# Altium project AMS LV.PrjPcb
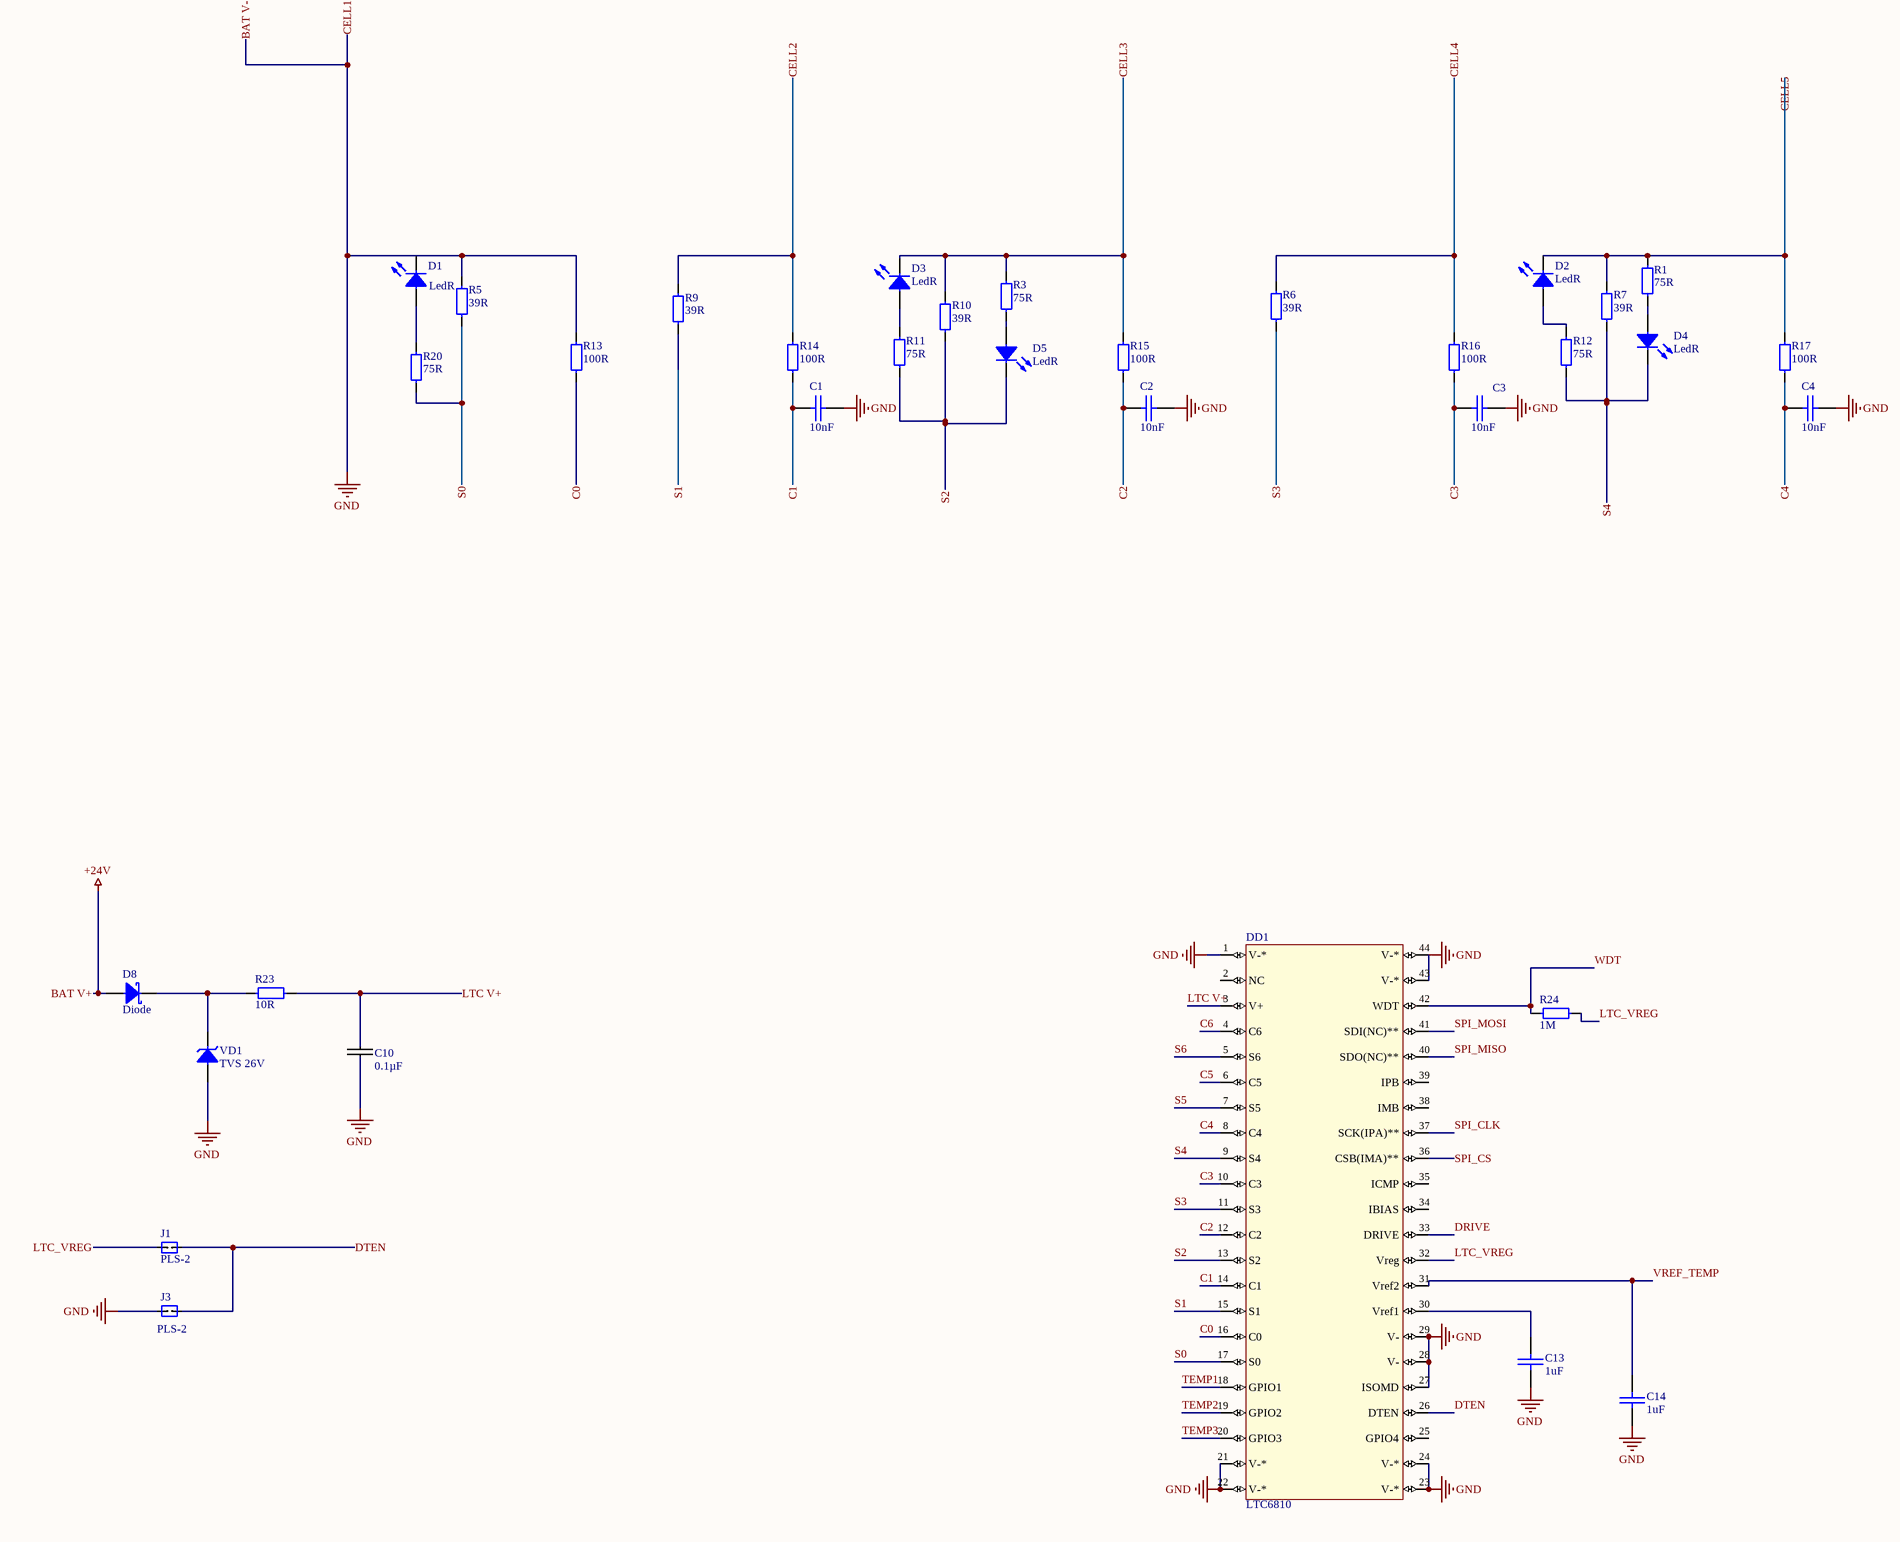
[diagram p0: AMS_LV_6.SchDoc, top left]
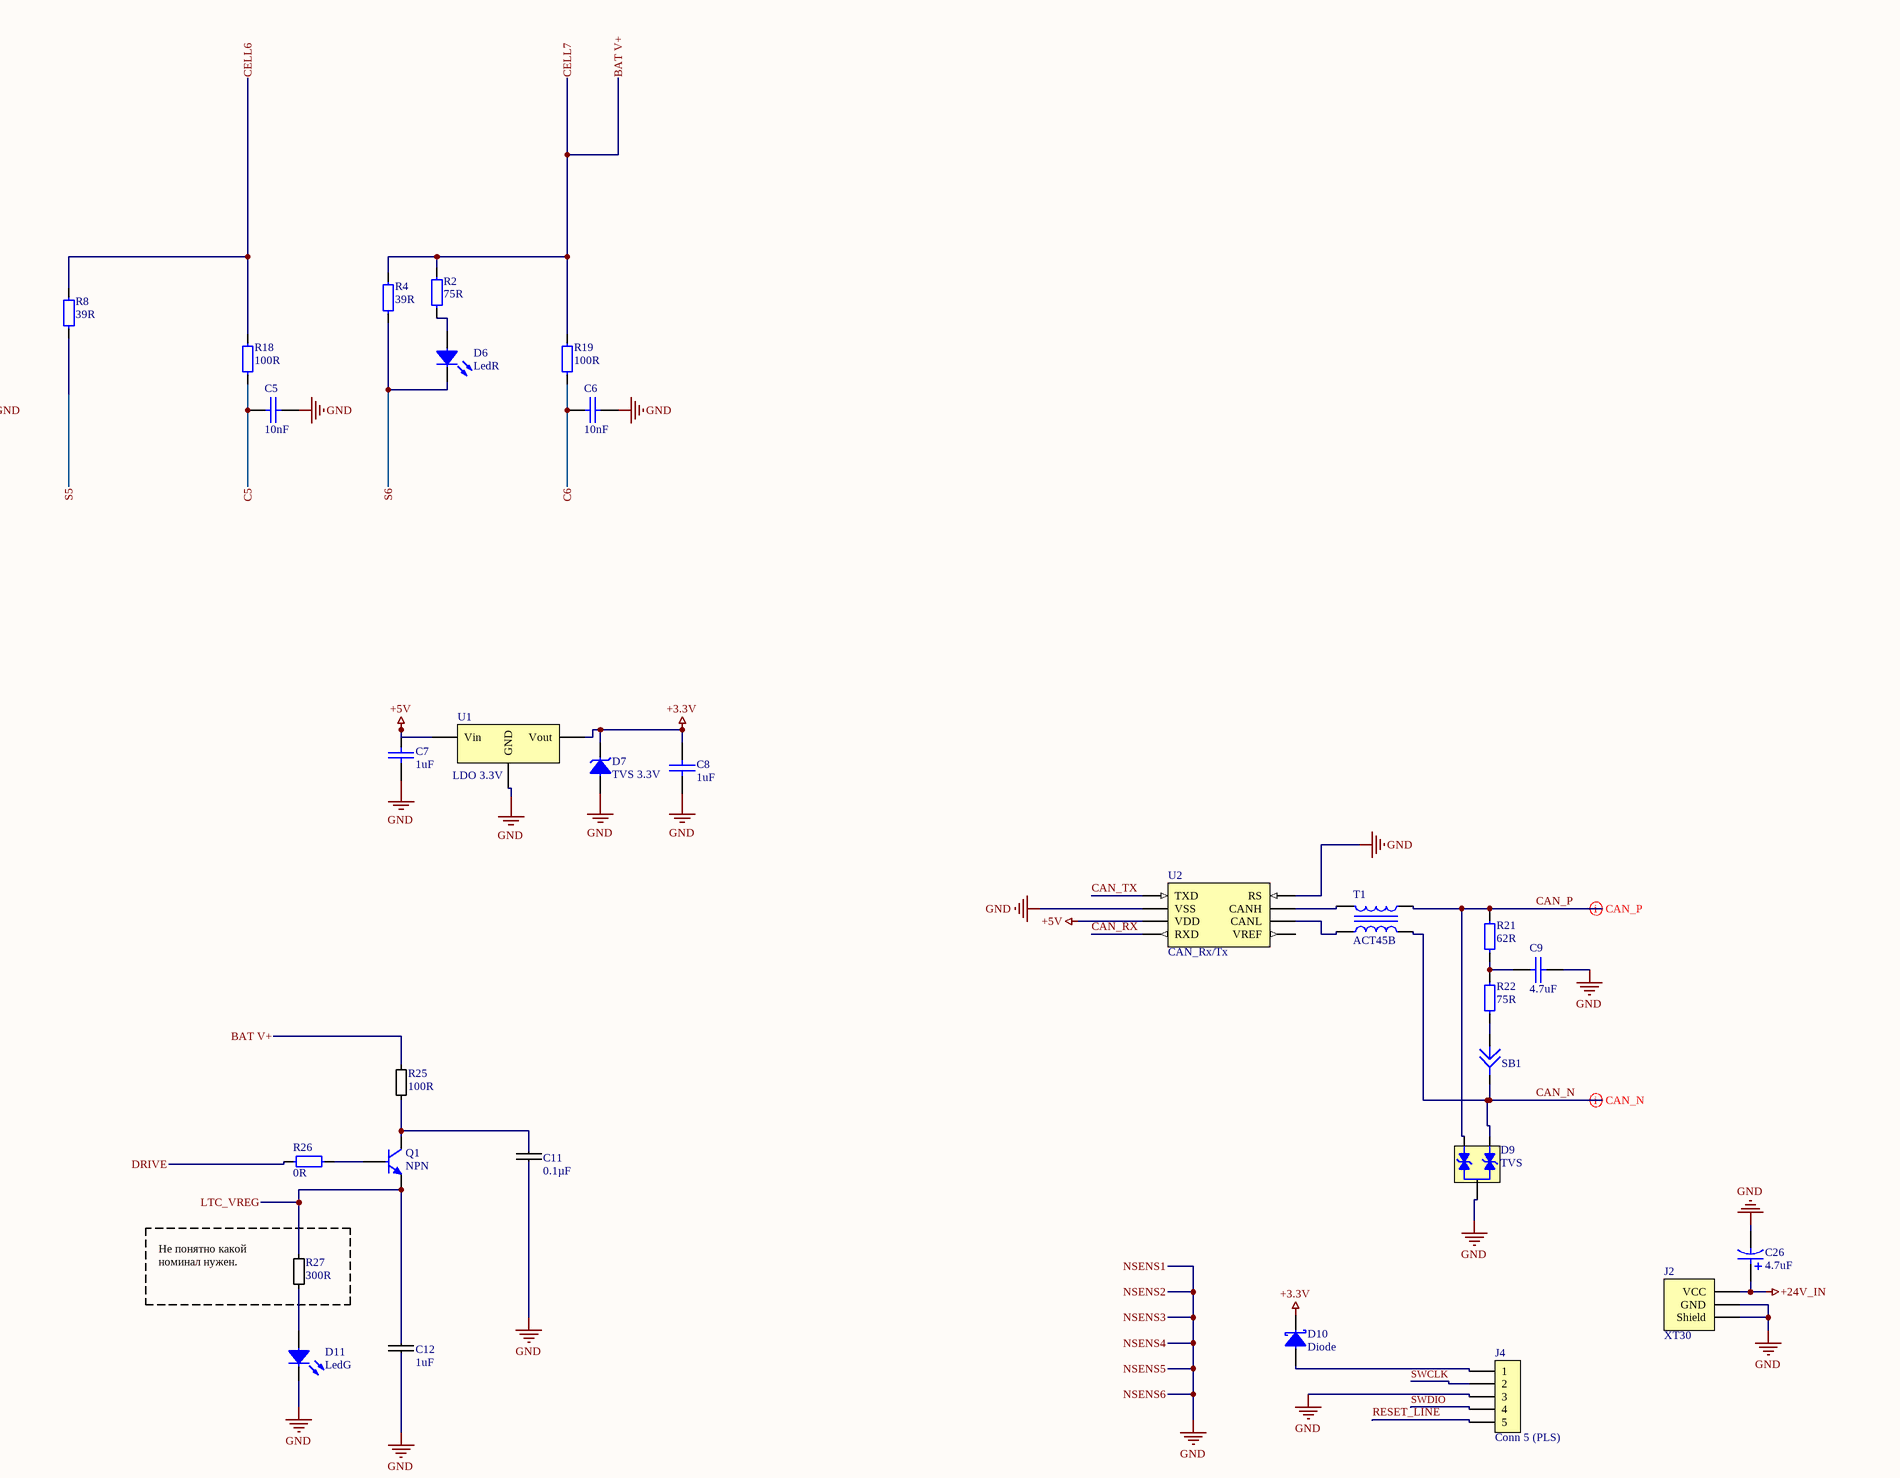
[diagram p1: AMS_LV_6.SchDoc, top right]
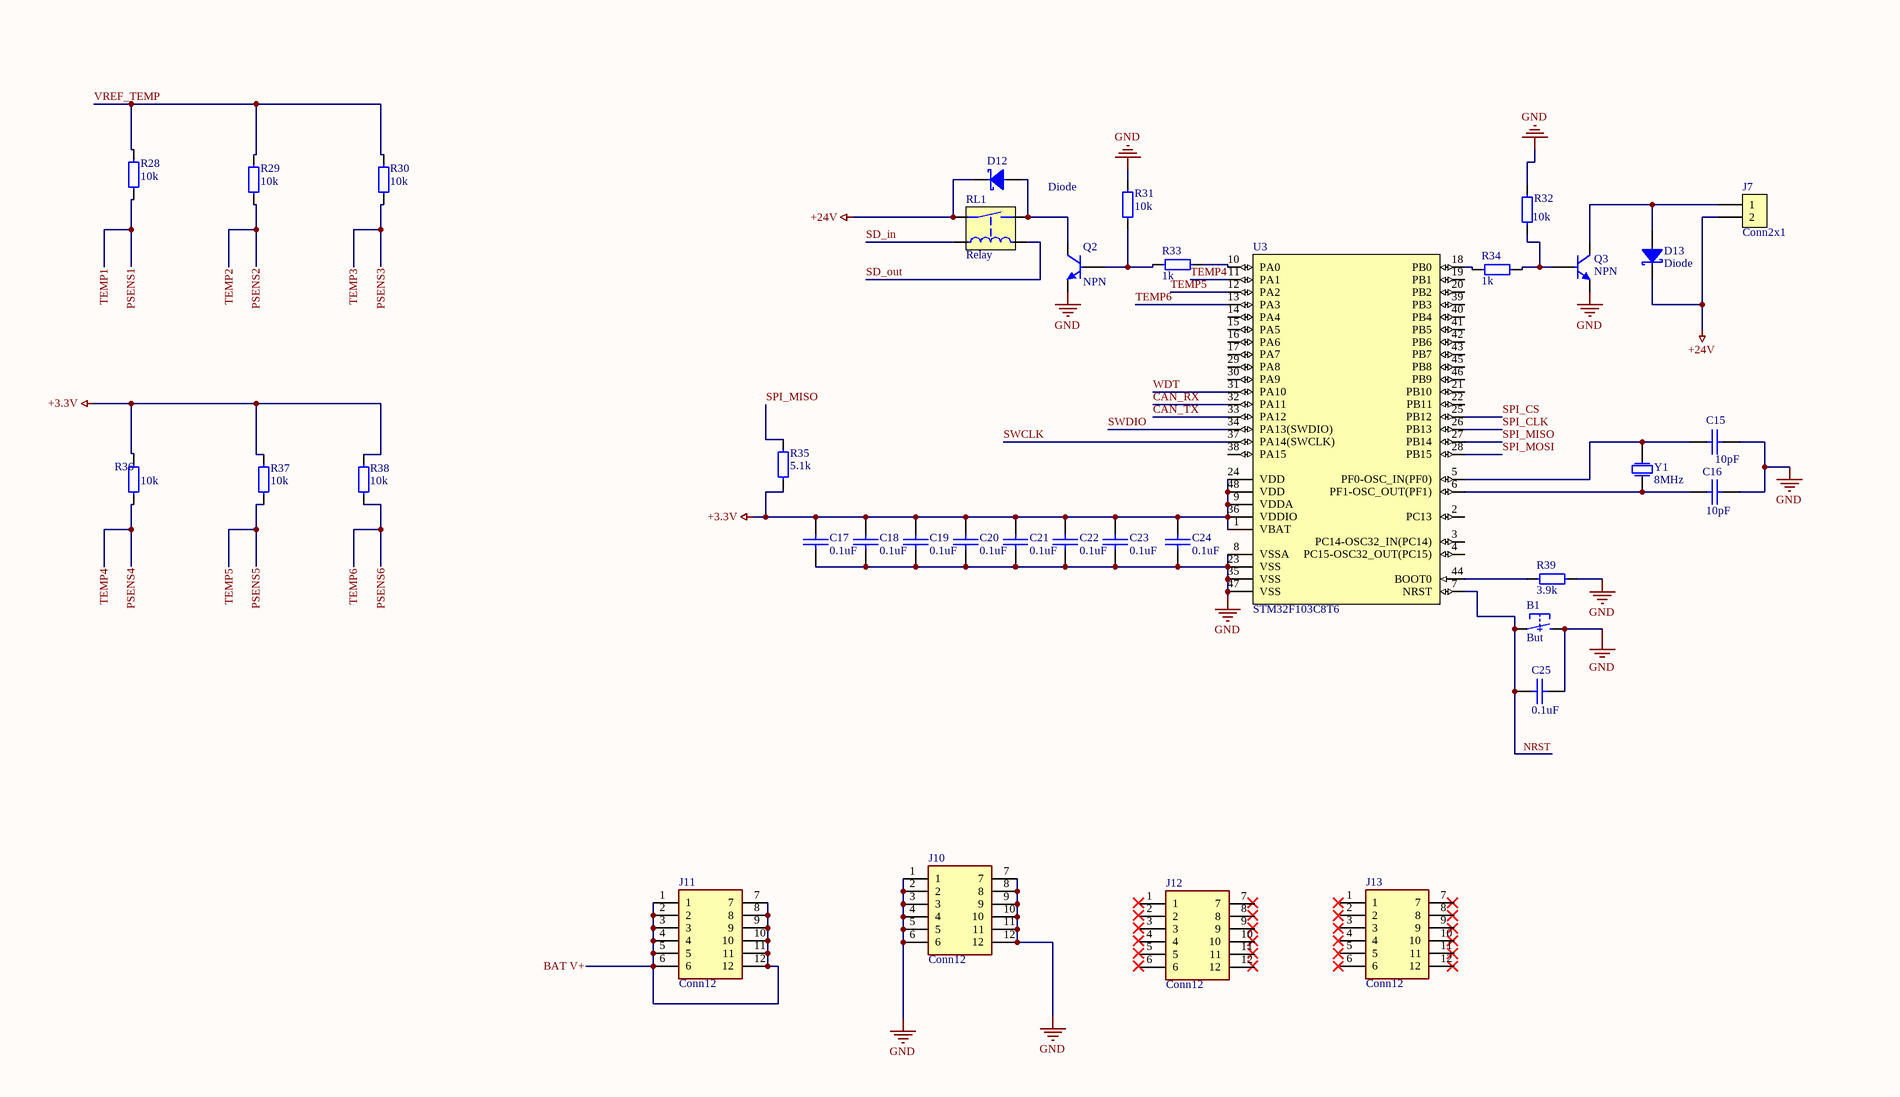
[diagram p2: AMS_LV_6.SchDoc, bottom left]
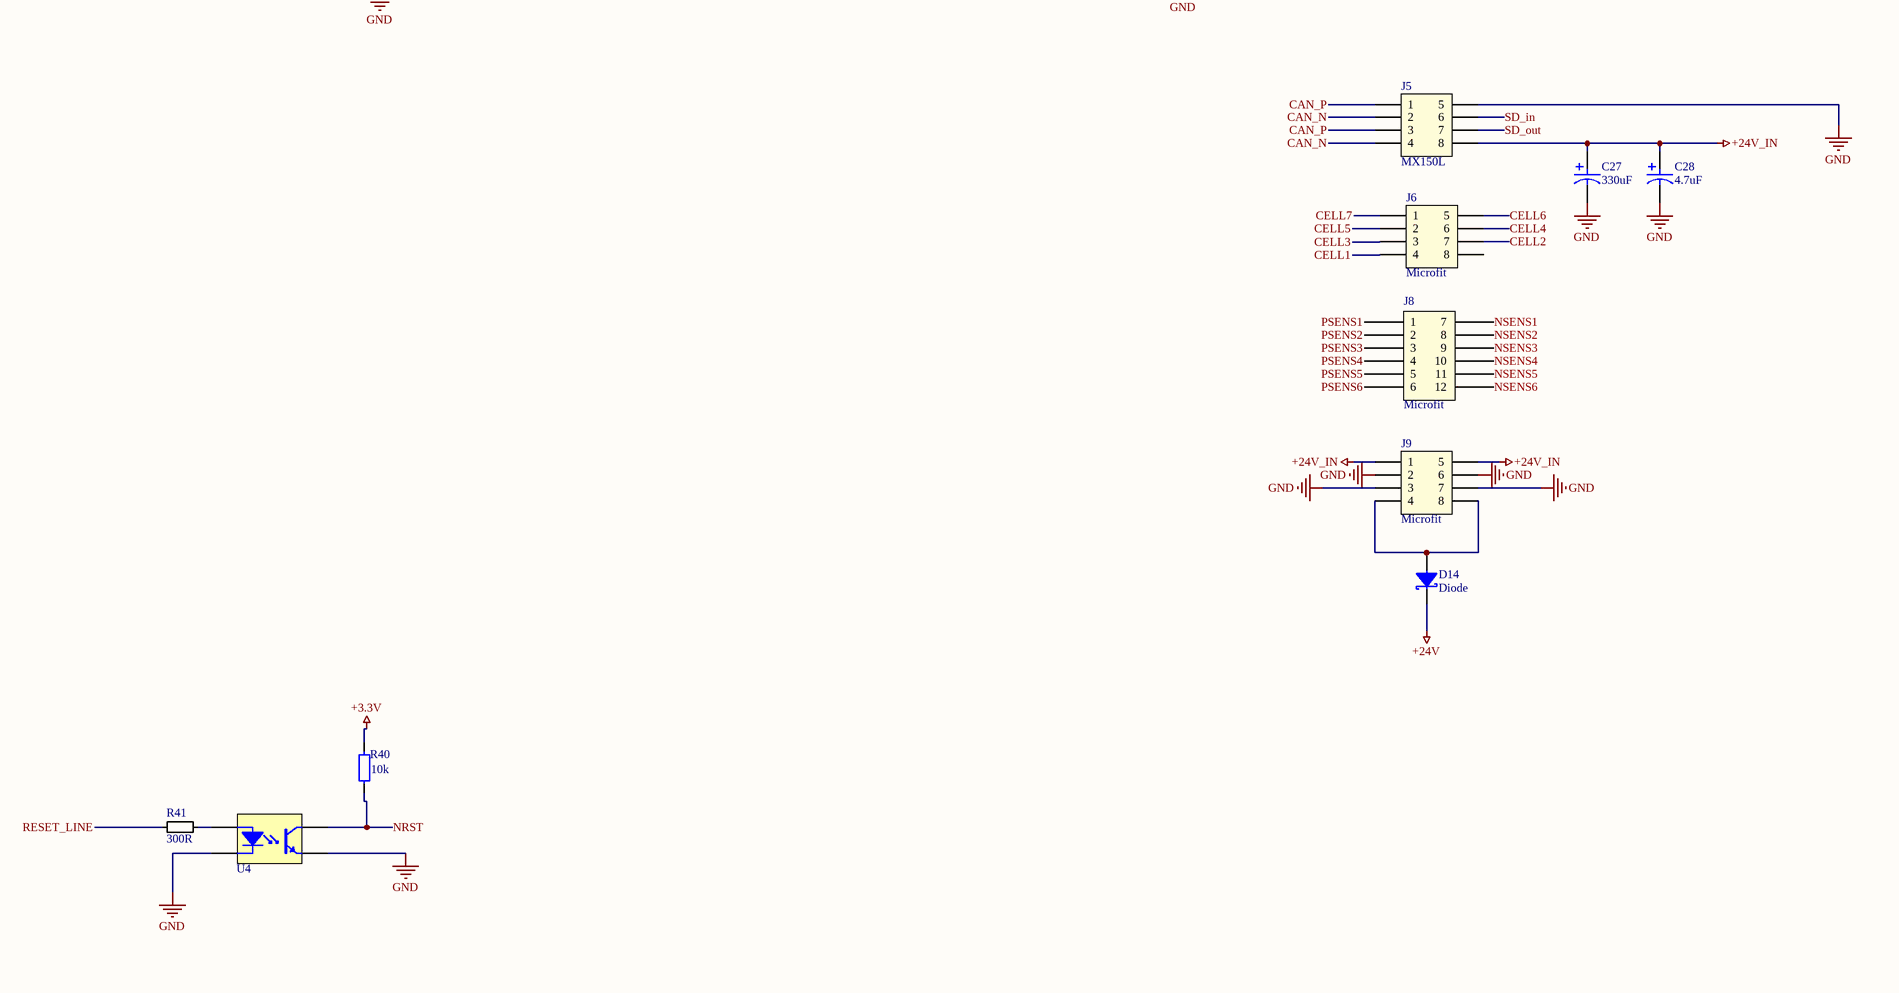
[diagram p3: AMS_LV_6.SchDoc, bottom right]
2 sheets, 121 parts. Net scope: global (net labels, ports and power ports of the same name join across sheets).
Board file: AMS-LV.PcbDoc
Sheets:
  AMS_LV_6.SchDoc
  DC-DC_4-36V_2A.SchDoc

## Sheet AMS_LV_6.SchDoc: AMS Slave mk1
size A1; CheckedBy: h; Author: 0; CompanyName: n; Organization: Altium Limited; Address1: FS BMSTU; Address2: Ildar_BH; ListNumber: 1

### Parts
B1  But  [BUTTON 4x3]
C1  10nF  [0603 Capicator]
C2  10nF  [0603 Capicator]
C3  10nF  [0603 Capicator]
C4  10nF  [0603 Capicator]
C5  10nF  [0603 Capicator]
C6  10nF  [0603 Capicator]
C7  1uF  [0603 Capicator]
C8  1uF  [0603 Capicator]
C9  4.7uF  [0603 Capicator]
C10  0.1µF  [Cap 0.1µF (1206)]
C11  0.1µF  [Cap 0.1µF (1206)]
C12  1uF  [Cap 0.1µF (1206)]
C13  1uF  [0603 Capicator]
C14  1uF  [0603 Capicator]
C15  10pF  [0603 Capicator]
C16  10pF  [0603 Capicator]
C17  0.1uF  [0603 Capicator]
C18  0.1uF  [0603 Capicator]
C19  0.1uF  [0603 Capicator]
C20  0.1uF  [0603 Capicator]
C21  0.1uF  [0603 Capicator]
C22  0.1uF  [0603 Capicator]
C23  0.1uF  [0603 Capicator]
C24  0.1uF  [0603 Capicator]
C25  0.1uF  [0603 Capicator]
C26  4.7uF  [Bar Cap 4x5.4]
C27  330uF  [Bar Cap 8x10.5]
C28  4.7uF  [Bar Cap 4x5.4]
D1  LedR  [0805 LED]
D2  LedR  [0805 LED]
D3  LedR  [0805 LED]
D4  LedR  [0805 LED]
D5  LedR  [0805 LED]
D6  LedR  [0805 LED]
D7  TVS 3.3V  [DO-216AA]
D8  Diode  [SMB]
D9  TVS  [SOT-23]
D10  Diode  [sod-123]
D11  LedG  [0805 LED]
D12  Diode  [SMA]
D13  Diode  [SMA]
D14  Diode  [TO-220-3]
DD1  LTC6810  [LTC6810-1]
J1  PLS-2  [Conn PLS-2]
J2  XT30  [HEADER 2 XT30PW Male]
J3  PLS-2  [Conn PLS-2]
J4  Conn 5 (PLS)  [PLS 5x1]
J5  MX150L  [Conn 4x2 [MX150L]]
J6  Microfit  [Microfit_4x2]
J7  Conn2x1  [MolexMicroFit 2x1]
J8  Microfit  [Microfit_6x2]
J9  Microfit  [Microfit_4x2]
J10  Conn12  [7460408]
J11  Conn12  [7460408]
J12  Conn12  [7460408]
J13  Conn12  [7460408]
Q1  NPN  [SOT-223]
Q2  NPN  [SOT-223]
Q3  NPN  [SOT-223]
R1  75R  [0805 Resistor]
R2  75R  [0805 Resistor]
R3  75R  [0805 Resistor]
R4  39R  [RES 39R (2512)]
R5  39R  [RES 39R (2512)]
R6  39R  [RES 39R (2512)]
R7  39R  [RES 39R (2512)]
R8  39R  [RES 39R (2512)]
R9  39R  [RES 39R (2512)]
R10  39R  [RES 39R (2512)]
R11  75R  [0805 Resistor]
R12  75R  [0805 Resistor]
R13  100R  [RES 100R (603)]
R14  100R  [RES 100R (603)]
R15  100R  [RES 100R (603)]
R16  100R  [RES 100R (603)]
R17  100R  [RES 100R (603)]
R18  100R  [RES 100R (603)]
R19  100R  [RES 100R (603)]
R20  75R  [0805 Resistor]
R21  62R  [0603 Resistor]
R22  75R  [0805 Resistor]
R23  10R  [RES 10R (603)]
R24  1M  [0805 Resistor]
R25  100R  [Res 100R (1206)]
R26  0R  [0603 Resistor]
R27  300R  [Res 300R (603)]
R28  10k  [0603 Resistor]
R29  10k  [0603 Resistor]
R30  10k  [0603 Resistor]
R31  10k  [0603 Resistor]
R32  10k  [0603 Resistor]
R33  1k  [0603 Resistor]
R34  1k  [0603 Resistor]
R35  5.1k  [RES 5.1k (603)]
R36  10k  [0603 Resistor]
R37  10k  [0603 Resistor]
R38  10k  [0603 Resistor]
R39  3.9k  [0603 Resistor]
R40  10k  [0603 Resistor]
R41  300R  [Res 300R (603)]
RL1  Relay  [Relay(RE030024)]
SB1  Circuit Breaker  [SB 0603]  (value not drawn)
T1  ACT45B  [ACT45B]
U1  LDO 3.3V  [SOT-23]
U2  CAN_Rx/Tx  [SO-8]
U3  STM32F103C8T6  [LQFP48]
U4  Opt  [Optocupler [LTV-817S]]  (value not drawn)
VD1  TVS 26V  [TVS Diode 26V [SMF26A]]
Y1  8MHz  [hc-49sm]

### Nets
+3.3V: C8.2 C17.2 C18.2 C19.2 C20.2 C21.2 C22.2 C23.2 C24.2 D7.2 D10.2 R35.1 R36.2 R37.2 R38.2 R40.2 U1.2(Vout) U3.1(VBAT) U3.9(VDDA) U3.24(VDD) U3.36(VDDIO) U3.48(VDD)
+5V: C7.2 U1.3(Vin) U2.3(VDD)
+24V_IN: C26.2 C27.2 C28.2 J2.1(VCC) J5.8 J9.1 J9.5
BAT V+: D8.1 D12.2 D13.2 D14.2 J6.1 J7.2 J11.1 J11.2 J11.3 J11.4 J11.5 J11.6 J11.7 J11.8 J11.9 J11.10 J11.11 J11.12 R2.2 R4.2 R19.2 R25.2 RL1.4  [also labelled +24V, CELL7]
BAT V-: B1.2 C1.2 C2.2 C3.2 C4.2 C5.2 C6.2 C7.1 C8.1 C9.2 C10.2 C11.2 C12.2 C13.1 C14.1 C15.2 C16.2 C17.1 C18.1 C19.1 C20.1 C21.1 C22.1 C23.1 C24.1 C25.1 C26.1 C27.1 C28.1 D1.2 D7.1 D9.3 D11.2 DD1.1(V-*) DD1.21(V-*) DD1.22(V-*) DD1.23(V-*) DD1.24(V-*) DD1.27(ISOMD) DD1.28(V-) DD1.29(V-) DD1.43(V-*) DD1.44(V-*) J2.2(GND) J2.A(Shield) J3.2 J4.3 J5.5 J6.4 J8.7 J8.8 J8.9 J8.10 J8.11 J8.12 J9.2 J9.3 J9.6 J9.7 J10.1 J10.2 J10.3 J10.4 J10.5 J10.6 J10.7 J10.8 J10.9 J10.10 J10.11 J10.12 Q2.3 Q3.3 R5.2 R13.2 R31.2 R32.2 R39.2 U1.1(GND) U2.2(VSS) U2.8(RS) U3.8(VSSA) U3.23(VSS) U3.35(VSS) U3.47(VSS) U4.2(CATHODE) U4.3(EMITTER) VD1.2  [also labelled CELL1, GND, NSENS1, NSENS2, NSENS3, NSENS4, NSENS5, NSENS6]
C0: DD1.16(C0) R13.1
C1: C1.1 DD1.14(C1) R14.1
C2: C2.1 DD1.12(C2) R15.1
C3: C3.1 DD1.10(C3) R16.1
C4: C4.1 DD1.8(C4) R17.1
C5: C5.1 DD1.6(C5) R18.1
C6: C6.1 DD1.4(C6) R19.1
CAN_N: D9.1 J5.2 J5.4 SB1.1 T1.3
CAN_P: D9.2 J5.1 J5.3 R21.2 T1.4
CAN_RX: U2.4(RXD) U3.32(PA11)
CAN_TX: U2.1(TXD) U3.33(PA12)
CELL2: J6.7 R9.2 R14.2
CELL3: D3.2 J6.3 R3.2 R10.2 R15.2
CELL4: J6.6 R6.2 R16.2
CELL5: D2.2 J6.2 R1.2 R7.2 R17.2
CELL6: J6.5 R8.2 R18.2
DRIVE: DD1.33(DRIVE) R26.1
DTEN: DD1.26(DTEN) J1.1 J3.1
LTC V+: C10.1 DD1.3(V+) R23.2
LTC_VREG: C12.1 DD1.32(Vreg) J1.2 Q1.3 R24.2 R27.1
NRST: B1.1 C25.2 R40.1 U3.7(NRST) U4.4(COLLECTOR)
PSENS1: DD1.18(GPIO1) J8.1 R28.1  [also labelled TEMP1]
PSENS2: DD1.19(GPIO2) J8.2 R29.1  [also labelled TEMP2]
PSENS3: DD1.20(GPIO3) J8.3 R30.1  [also labelled TEMP3]
PSENS4: J8.4 R36.1 U3.11(PA1)  [also labelled TEMP4]
PSENS5: J8.5 R37.1 U3.12(PA2)  [also labelled TEMP5]
PSENS6: J8.6 R38.1 U3.13(PA3)  [also labelled TEMP6]
RESET_LINE: J4.5 R41.1
S0: DD1.17(S0) R5.1 R20.1
S1: DD1.15(S1) R9.1
S2: D5.2 DD1.13(S2) R10.1 R11.1
S3: DD1.11(S3) R6.1
S4: D4.2 DD1.9(S4) R7.1 R12.1
S5: DD1.7(S5) R8.1
S6: D6.2 DD1.5(S6) R4.1
SD_in: J5.6 RL1.1
SD_out: J5.7 RL1.2
SPI_CLK: DD1.37(SCK(IPA)**) U3.26(PB13)
SPI_CS: DD1.36(CSB(IMA)**) U3.25(PB12)
SPI_MISO: DD1.40(SDO(NC)**) R35.2 U3.27(PB14)
SPI_MOSI: DD1.41(SDI(NC)**) U3.28(PB15)
SWCLK: J4.2 U3.37(PA14(SWCLK))
SWDIO: J4.4 U3.34(PA13(SWDIO))
VREF_TEMP: C14.2 DD1.31(Vref2) R28.2 R29.2 R30.2
WDT: DD1.42(WDT) R24.1 U3.31(PA10)
NetC9_1: C9.1 R21.1 R22.2
NetC11_1: C11.1 Q1.2 R25.1
NetC13_2: C13.2 DD1.30(Vref1)
NetC15_1: C15.1 U3.5(PF0-OSC_IN(PF0)) Y1.2
NetC16_1: C16.1 U3.6(PF1-OSC_OUT(PF1)) Y1.1
NetD1_1: D1.1 R20.2
NetD2_1: D2.1 R12.2
NetD3_1: D3.1 R11.2
NetD4_1: D4.1 R1.1
NetD5_1: D5.1 R3.1
NetD6_1: D6.1 R2.1
NetD8_2: D8.2 R23.1 VD1.1
NetD10_1: D10.1 J4.1
NetD11_1: D11.1 R27.2
NetD12_1: D12.1 Q2.2 RL1.3
NetD13_1: D13.1 J7.1 Q3.2
NetD14_1: D14.1 J9.4 J9.8
NetQ1_1: Q1.1 R26.2
NetQ2_1: Q2.1 R31.1 R33.2
NetQ3_1: Q3.1 R32.1 R34.1
NetR22_1: R22.1 SB1.2
NetR33_1: R33.1 U3.10(PA0)
NetR34_2: R34.2 U3.18(PB0)
NetR39_1: R39.1 U3.44(BOOT0)
NetR41_2: R41.2 U4.1(ANODE)
NetT1_1: T1.1 U2.7(CANH)
NetT1_2: T1.2 U2.6(CANL)

Not connected (* = marked no-connect by the designer): DD1 2(NC) 25(GPIO4) 34(IBIAS) 35(ICMP) 38(IMB) 39(IPB); J6 8; J12 1 2 3 4 5 6 7 8 9 10 11 12; J13 1 2 3 4 5 6 7 8 9 10 11 12; U2 5(VREF); U3 2(PC13) 3(PC14-OSC32_IN(PC14)) 4(PC15-OSC32_OUT(PC15)) 14(PA4) 15(PA5) 16(PA6) 17(PA7) 19(PB1) 20(PB2) 21(PB10) 22(PB11) 29(PA8) 30(PA9) 38(PA15) 39(PB3) 40(PB4) 41(PB5) 42(PB6) 43(PB7) 45(PB8) 46(PB9)

### Layout directives
differential pair; differential pair class *: CAN_N
differential pair: CAN_P

### Notes on the sheet
- Допускаются емкости от 10nF до 15nF
- (near R27) Не понятно какой номинал нужен.
- Title
- Size:
- Date:
- File:
- A1
- Number:
- Time:
- Revision:
- Sheet
- of

### Library data of the parts
B1 = Button 2 Conn: Button 2 Conn SMD; Part Number: L-KLS7-TS3608-5.0-180; Manufacturer: KLS electronic co ltd; Type: Button; ComponentLink1Description: Chip&Dip; ComponentLink1URL: https://www.chipdip.ru/product/kls7-ts3608-5.0-180-td-02xa
C1-C6 = Cap 10nF (0603): X7R 10nF 100V 10% 0603; Manufacturer: Murata Manufacturing; Part Number: GRM188R72A103KA01D; Type: Capacitor; ComponentLink1Description: Chip&Dip; ComponentLink1URL: https://www.chipdip.ru/product/grm188r72a103ka01d
C7 C8 C13 C14 = Cap 1uF (0603): 1uF X5R 25V 10% 0603; Manufacturer: Murata Manufacturing; Part Number: GRM188R61E105KAADD; Type: Capacitor; ComponentLink1Description: Chip&Dip; ComponentLink1URL: https://www.chipdip.ru/product/grm188r61e105k
C9 = Cap 4.7uF (0603): 4.7uF X5R 25V 10% 0603; Manufacturer: Murata Manufacturing; Part Number: GRM188R61E475KE11D; Type: Capacitor; ComponentLink1Description: Chip&Dip; ComponentLink1URL: https://www.chipdip.ru/product0/9000348448
C10 C11 = Cap 0.1µF (1206): CERAMIC CAPACITOR 0.1uF, 100V, 10%, 1206; ComponentLink1Description: ChipDip; ComponentLink1URL: https://www.chipdip.ru/product/ld061c104kab2a; ComponentLink2Description: DataSheet; ComponentLink2URL: http://www.farnell.com/datasheets/2097579.pdf; Type: Capacitor
C12 = Cap 1µF (1206): 1uF 100V 10%; Type: Capacitor; ComponentLink1Description: Chip Dip; ComponentLink1URL: https://www.chipdip.ru/product/12061c105k4z2a-smd-mlcc-1206-100v-x7r-1u-1; ComponentLink2Description: Datasheet; ComponentLink2URL: http://www.farnell.com/datasheets/2237835.pdf
C15 C16 = Cap 10pF (0603): 10pF NP0 50V 5% 0603; Manufacturer: Murata Manufacturing; Part Number: GRM1885C1H100JA01D; Type: Capacitor; ComponentLink1Description: Chip&Dip; ComponentLink1URL: https://www.chipdip.ru/product/grm1885c1h100j
C17-C25 = Cap 0.1uF (0603): 0.1uF X7R 16V 10% 0603; Manufacturer: Murata Manufacturing; Part Number: GRM188R71C104KA01D; Type: Capacitor; ComponentLink1Description: Chip&Dip; ComponentLink1URL: https://www.chipdip.ru/product/grm188r71c104ka01d
C26 C28 = Cap Pol 4.7uF: ECAP SMD,  35V, 105°C; Part Number: B41121A7475M000; Manufacturer: Epcos; Type: Capacitor; ComponentLink1Description: Chip&Dip; ComponentLink1URL: https://www.chipdip.ru/product/b41121a7475m000
C27 = Cap Pol 330uF: ECAP SMD,  16V, 105°C, 20%; Part Number: JCK1C331M080105; Manufacturer: JB; Type: Capacitor; ComponentLink1Description: Chip&Dip; ComponentLink1URL: https://www.chipdip.ru/product0/9000565746
D1-D6 = Led Red: SMD 1608, 112mcd, 120°, 630nM (Ultra Bright Red); Part Number: TO-1608BC-MRE; Manufacturer: Taiwan Oasis Technology; Type: Diode; ComponentLink1Description: Chip&Dip; ComponentLink1URL: https://www.chipdip.ru/product/to-1608bc-mre
D7 = TVS Diode 3.3V [SM2T]: High peak pulse power: 200 W (10/1000 μs); Part Number: SM2T3V3A; Manufacturer: STMicroelectronics; Type: Diode; ComponentLink1Description: DataSheet; ComponentLink1URL: https://www.st.com/resource/en/datasheet/sm2t3v3a.pdf; ComponentLink2Description: Chip&Dip; ComponentLink2URL: https://www.chipdip.ru/product0/8283670575
D8 = Diode Schottky (SMB): Diode Schottky 5A 40V; Part Number: SK54; Manufacturer: Diotec Semiconductor; Type: Diode; ComponentLink1Description: DataSheet; ComponentLink1URL: https://static.chipdip.ru/lib/092/DOC001092363.pdf; ComponentLink2Description: Chip&Dip; ComponentLink2URL: https://www.chipdip.ru/product/sk54
D9 = TVS Diode Arrays: Part Number: SM24CANB-02HTG; Manufacturer: Littelfuse; Type: Diode; ComponentLink1Description: DataSheet; ComponentLink1URL: https://m.littelfuse.com/~/media/electronics/datasheets/tvs_diode_arrays/littelfuse_tvs_diode_array_sm24canb_datasheet.pdf.pdf; ComponentLink2Description: Chip&Dip; ComponentLink2URL: https://www.chipdip.ru/product1/8001779022
D10 = Diode Schottky (SOD-123): 0.5 A, Low Forward Voltage less than 385 mV, 400 mW Power Dissipation Package; Part Number: MBR0520L; Manufacturer: ON Semiconductor; Type: Diode; ComponentLink1Description: DataSheet; ComponentLink1URL: http://www.farnell.com/datasheets/1875336.pdf; ComponentLink2Description: Chip&Dip; ComponentLink2URL: https://www.chipdip.ru/product/mbr0520l
D11 = Led Green: Led Green SMD 1608, 120°, 525nM; Part Number: TO-1608BC-PG; Manufacturer: Taiwan Oasis Technology; Type: Diode; ComponentLink1Description: Chip&Dip; ComponentLink1URL: https://www.chipdip.ru/product/to-1608bc-pg
D12 D13 = Diode Schottky (SMA): Diode Schottky 3A 40V; Part Number: B340A-E3/61T; Manufacturer: Vishay; Type: Diode; ComponentLink1Description: DataSheet; ComponentLink1URL: https://static.chipdip.ru/lib/652/DOC001652710.pdf; ComponentLink2Description: Chip&Dip; ComponentLink2URL: https://www.chipdip.ru/product/b340a-e3-61t-2
D14 = Diode Schottky [TO-220-3]: Diode Schottky 2 x 20A 45V; ComponentLink1Description: ChipDip; ComponentLink1URL: https://www.chipdip.ru/product/vs-40ctq045-m3-vishay; ComponentLink2Description: DataSheet; ComponentLink2URL: https://static.chipdip.ru/lib/208/DOC005208502.pdf
J1 J3 = Conn PLS-2: PLS-2 (DS1021-1x2); ComponentLink1Description: ChipDip; ComponentLink1URL: https://www.chipdip.ru/product/pls-2?yclid=7505697924270808350&utm_source=direct&utm_medium=cpc&position_type=premium%7Ck50id%7C010000001264065_Все%7Ccid%7C50598766%7Cgid%7C4147825070%7Caid%7C8822723075%7Csrc%7Csearch_none&utm_campaign=Y_dinamicheskaya&utm_content=text4_ya&utm_term=; ComponentLink2Description: Datasheet; ComponentLink2URL: https://static.chipdip.ru/lib/977/DOC005977245.pdf; Type: Connector
J2 = Connector XT30PW-Male: Part Number: XT30PW; Manufacturer: Amass; ComponentLink1Description: AliExpress; ComponentLink1URL: https://ru.aliexpress.com/item/4000070113352.html?spm=a2g0o.productlist.0.0.39dd34bfyYuspa&algo_pvid=4d7d83f5-6270-4220-b100-9b5f13b0846d&algo_expid=4d7d83f5-6270-4220-b100-9b5f13b0846d-3&btsid=c67bc929-e3be-4af3-9fd9-25ac13ce4818&ws_ab_test=searchweb0_0,searchweb201602_,searchweb201603_55; Type: Connector
J4 = Conn 5 (PLS): Header, 5-Pin; LatestRevisionDate: 17-Jul-2002; LatestRevisionNote: Re-released for DXP Platform.; Publisher: Altium Limited
J5 = Conn4x2 [MX150L]: 5.84mm Pitch MX150L Right-Angle PCB Header, Dual Row, without PCB Flange, 8 Circuits; Part Number: 194270017; Manufacturer: Molex; Type: Connector; ComponentLink1Description: Molex; ComponentLink1URL: https://www.molex.com/molex/products/part-detail/pcb_headers/0194270017
J6 J9 = Conn4x2 [Microfit]: PCB Mount Header, Right Angle,  Wire-to-Board; Part Number: 430450801; Manufacturer: Molex; Type: Connector; ComponentLink1Description: Molex; ComponentLink1URL: https://www.molex.com/molex/products/part-detail/pcb_headers/0430450801
J7 = Conn 2 [MicroFit]: Micro-Fit 3.0 Right-Angle Header, 3.00mm Pitch, Single Row, 2 Circuits, with Snap-in Plastic Peg PCB Lock, Tin, Glow-Wire Capable, Black; Part Number: 436500200; Manufacturer: Molex; ComponentLink1Description: Molex; ComponentLink1URL: https://www.molex.com/molex/products/part-detail/pcb_headers/0436500200; Type: Connector
J8 = Conn6x2 [Microfit]: PCB Mount Header, Right Angle,  Wire-to-Board; Part Number: 430451200; Manufacturer: Molex; Type: Connector; ComponentLink1Description: Molex; ComponentLink1URL: https://www.molex.com/molex/products/part-detail/pcb_headers/0430451200
J10-J13 = Conn12: PCB terminal block, bushing, M5; Manufacturer_Name: Wurth Elektronik*; Datasheet link: http://katalog.we-online.com/em/datasheet/7460408.pdf; ComponentLink1Description: ChipDip; ComponentLink1URL: https://www.chipdip.ru/product/7460408-1; ComponentLink2Description: Datasheet; ComponentLink2URL: http://www.farnell.com/datasheets/1736664.pdf; Height: 6mm; Manufacturer_Part_Number: 7460408; Mouser Part Number: 710-7460408; Mouser Price/Stock: https://www.mouser.co.uk/ProductDetail/Wurth-Elektronik/7460408?qs=lykWx4dhCCG7IAhyxQ5B4w%3D%3D; Type: Terminal block
Q1-Q3 = NPN [PBS]: NPN low VCEsat transistor in a SOT223 plastic package; Part Number: PBSS4540Z,115; Manufacturer: Nexperia; Type: Transistor; ComponentLink1Description: DataSheet; ComponentLink1URL: https://static.chipdip.ru/lib/583/DOC001583057.pdf; ComponentLink2Description: Chip&Dip; ComponentLink2URL: https://www.chipdip.ru/product/pbss4540z.115
R1-R3 R11 R12 R20 R22 = Res 75R (0805): 0.125W 0805 75R, 1%; Part Number: RC0805FR-0775RL; Manufacturer: Taiwan; Type: Resistor; ComponentLink1Description: Chip&Dip; ComponentLink1URL: https://www.chipdip.ru/product0/9000079459
R4-R10 = Res 39R (2512): 2512 47R 1%; ComponentLink1Description: ChipDip; ComponentLink1URL: https://www.chipdip.ru/product0/9000190077?from=suggest_product; ComponentLink2Description: Datasheet; ComponentLink2URL: https://static.chipdip.ru/lib/788/DOC004788200.pdf; Type: Resistor
R13-R19 = Res 100R (603): 603 100R 1% 0.1W; ComponentLink1Description: ChipDip; ComponentLink1URL: https://www.chipdip.ru/product0/9000079616; ComponentLink2Description: Datasheet; ComponentLink2URL: https://static.chipdip.ru/lib/788/DOC004788200.pdf; Type: Resistor
R21 = Res 62R (0603): 0.1W 0603 62R, 1%; Part Number: RC0603FR-0762RL; Manufacturer: Taiwan; Type: Resistor; ComponentLink1Description: Chip&Dip; ComponentLink1URL: https://www.chipdip.ru/product0/9000079611
R23 = Res 10R (603): 603 10R 75V; ComponentLink1Description: ChipDip; ComponentLink1URL: https://www.chipdip.ru/product/crcw060310r0fkea; ComponentLink2Description: Datasheet; ComponentLink2URL: http://www.farnell.com/datasheets/2310790.pdf; Type: Resistor
R24 = Res 1M (0805): 0.125W 0805 1 MR, 5%; Part Number: RC0805JR-071ML; Manufacturer: Taiwan; ComponentLink2Description: Chip&Dip; ComponentLink2URL: https://www.chipdip.ru/product0/830469679; Type: Resistor
R25 = Res 100R (1206): 1206 100R 1%; ComponentLink1Description: Chip Dip; ComponentLink1URL: https://www.chipdip.ru/product/cr1206-fx-1000elf-smd-1206-thick-film-resis; ComponentLink2Description: Datasheet; ComponentLink2URL: http://www.farnell.com/datasheets/2178762.pdf; Type: Resistor
R26 = Res 0R (0603): 0.1W 0603 0R, 5%; Part Number: RC0603JR-070RL; Manufacturer: Taiwan; Type: Resistor; ComponentLink1Description: Chip&Dip; ComponentLink1URL: https://www.chipdip.ru/product0/9000070541
R27 R41 = Res 300R (603): 0603 300R 1%; ComponentLink1Description: ChipDip; ComponentLink1URL: https://www.chipdip.ru/product0/9000079627; ComponentLink2Description: DataSheet; ComponentLink2URL: https://static.chipdip.ru/lib/788/DOC004788200.pdf; Type: Resistor
R28-R32 R36-R38 R40 = Res 10k (0603): 0.1W 0603 10k, 1%; Part Number: RC0603FR-0710KL; Manufacturer: Taiwan; Type: Resistor; ComponentLink1Description: Chip&Dip; ComponentLink1URL: https://www.chipdip.ru/product0/9000079736
R33 R34 = Res 1k (0603): 0.1W 0603 1k, 1%; Part Number: RC0603FR-071KL; Manufacturer: Taiwan; Type: Resistor; ComponentLink1Description: Chip&Dip; ComponentLink1URL: https://www.chipdip.ru/product0/9000079676
R35 = Res 5.1k (603): 0.1W 0603 5.1 kOhm, 1%; ComponentLink1Description: ChipDip; ComponentLink1URL: https://www.chipdip.ru/product0/9000079729; ComponentLink2Description: Datasheet; ComponentLink2URL: https://static.chipdip.ru/lib/788/DOC004788200.pdf; Type: Resistor
R39 = Res 3.9k (0603): 0.1W 0603 3.9k, 1%; Part Number: RC0603FR-073K9L; Manufacturer: Taiwan; Type: Resistor; ComponentLink1Description: Chip&Dip; ComponentLink1URL: https://www.chipdip.ru/product0/9000079726
RL1 = Relay 24V 6A: Coil voltage: 24V; 6A max; Manufacturer: TE Connectivity; Part Number: RE030024; Type: Relay; ComponentLink1Description: Chip&Dip; ComponentLink1URL: https://www.chipdip.ru/product/tyco-re030024-1393217-8; ComponentLink2Description: Datasheet; ComponentLink2URL: https://static.chipdip.ru/lib/975/DOC000975764.pdf
T1 = ACT45B: Common mode filters / Automotive signal line (for power train/safety); Manufacturer: EMC Components; Part Number: ACT45B-510-2P-TL003; Type: Inductor; ComponentLink1Description: DataSheet; ComponentLink1URL: https://product.tdk.com/info/en/catalog/datasheets/cmf_automotive_signal_act45b_en.pdf
U1 = LDO 3.3V [MCP]: A family of CMOS low dropout (LDO)voltage  regulators  that  can  deliver  up  to  250 mA  ofcurrent  while  consuming  only  1.6 μA  of  quiescentcurrent (typical). The input operating range is specifiedfrom 2.3V to 6.0V; Part Number: MCP1700T-3302E/TT; Manufacturer: Microchip; ComponentLink1Description: DataSheet; ComponentLink1URL: https://static.chipdip.ru/lib/276/DOC000276804.pdf; ComponentLink2Description: Chip&Dip; ComponentLink2URL: https://www.chipdip.ru/product/mcp1700t-3302e-tt; ComponentLink3Description: Elitan; ComponentLink3URL: https://www.elitan.ru/price/item595361
U2 = CAN Transceiver [MCP2551]: High-speed  CAN,  fault-tolerantdevice  that  serves  as  the  interface  between  a  CANprotocol controller and the physical bus.; Part Number: MCP2551-I/SN; Manufacturer: Microchip; ComponentLink1Description: DataSheet; ComponentLink1URL: https://static.chipdip.ru/lib/204/DOC000204457.pdf; ComponentLink2Description: Chip&Dip; ComponentLink2URL: https://www.chipdip.ru/product/mcp2551-i-sn; Type: IC
U3 = STM32F103C8T6: Cortex™-M3 32-bit RISC core operating at a 72 MHz frequency; Manufacturer: STMicroelectronics; Part Number: STM32F103C8T6; ComponentLink1Description: DataSheet; ComponentLink1URL: https://static.chipdip.ru/lib/235/DOC000235733.pdf; ComponentLink2Description: Chip&Dip; ComponentLink2URL: https://www.chipdip.ru/product/stm32f103c8t6; Type: IC
U4 = Optocupler [LTV-817S]: LTV-817S, 5000 Vrms, SMD-4, 4-pin, -30...+110 degC; ComponentLink1Description: ChipDip; ComponentLink1URL: https://www.chipdip.ru/product0/8001777801; ComponentLink2Description: Datasheet; ComponentLink2URL: https://static6.arrow.com/aropdfconversion/acb51fbce558b47de527fd2f65fc66930fdd9300/2s_110_ltv-817202082720208472020m20s20s-ta20s-t.pdf
VD1 = TVS Diode 26V [SMF26A]: SMF26A 200W; Type: Diode; ComponentLink1Description: ChipDip; ComponentLink1URL: https://www.chipdip.ru/product/smf26a; ComponentLink2Description: Datasheet; ComponentLink2URL: https://static.chipdip.ru/lib/152/DOC001152952.pdf
Y1 = Crystal 8MHz SMD: Crystal. HC-49SM (US); Manufacturer: China; Part Number: 8.000MHzHC-49SM; Type: Crystal; ComponentLink1Description: Chip&Dip; ComponentLink1URL: https://www.chipdip.ru/product/8mhz-hc-49sm
DD1 = LTC6810: ComponentLink1Description: ChipDip; ComponentLink1URL: https://www.chipdip.ru/product1/8004965185; ComponentLink2Description: Datasheet; ComponentLink2URL: https://www.analog.com/ru/products/ltc6810-1.html#product-overview

## Sheet DC-DC_4-36V_2A.SchDoc
size A4
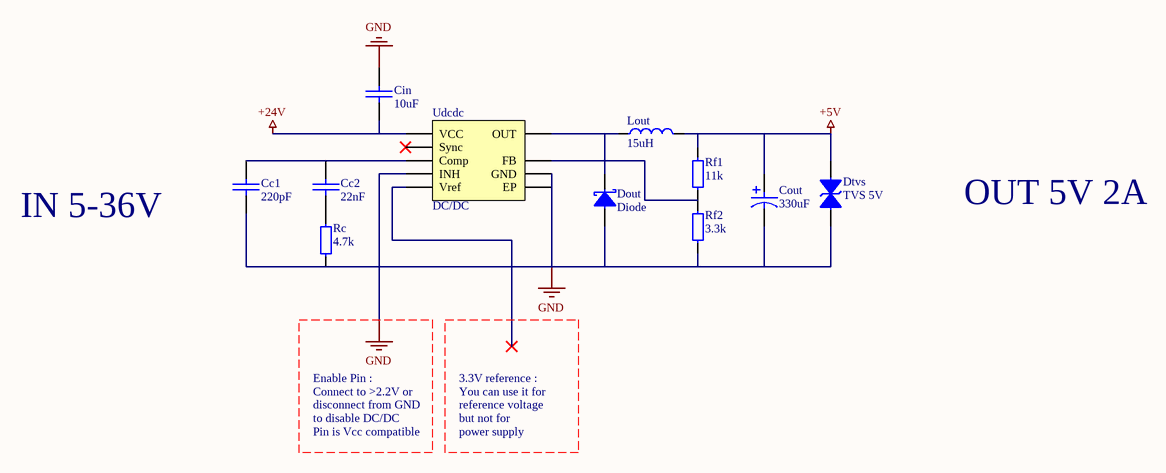
[diagram p4: DC-DC_4-36V_2A.SchDoc]

### Parts
Cc1  220pF  [0603 Capicator]
Cc2  22nF  [0603 Capicator]
Cin  10uF  [1210 CAPACITOR]
Cout  330uF  [Bar Cap 8x10.5]
Dout  Diode  [SMA]
Dtvs  TVS 5V  [sod-323]
Lout  15uH  [Inductor 7x7]
Rc  4.7k  [0603 Resistor]
Rf1  11k  [0603 Resistor]
Rf2  3.3k  [0603 Resistor]
Udcdc  DC/DC  [HSOP-8]

### Nets
+5V: Cout.2 Dtvs.1 Lout.2 Rf1.2
+24V: Cin.1 Udcdc.8(VCC)  [project net BAT V+]
GND: Cc1.1 Cin.2 Cout.1 Dout.1 Dtvs.2 Rc.1 Rf2.1 Udcdc.3(INH) Udcdc.7(GND) Udcdc.A(EP)  [project net BAT V-]
NetCc1_2: Cc1.2 Cc2.2 Udcdc.4(Comp)
NetCc2_1: Cc2.1 Rc.2
NetDout_2: Dout.2 Lout.1 Udcdc.1(OUT)
NetRf1_1: Rf1.1 Rf2.2 Udcdc.5(FB)

Not connected (* = marked no-connect by the designer): Udcdc 2(Sync)* 6(Vref)*

### Notes on the sheet
- IN 5-36V
- OUT 5V 2A
- Enable Pin :
- Connect to >2.2V or
- disconnect from GND
- 3.3V reference :
- You can use it for
- reference voltage
- to disable DC/DC
- Pin is Vcc compatible
- but not for
- power supply

### Library data of the parts
Cc1 = Cap 220pF (0603): 220pF NP0 50V 5% 0603; Manufacturer: Murata Manufacturing; Part Number: GRM1885C1H221J; Type: Capacitor; ComponentLink1Description: Chip&Dip; ComponentLink1URL: https://www.chipdip.ru/product/grm1885c1h221j
Cc2 = Cap 22nF (0603): 22nF X7R 50V 10% 0603; Manufacturer: Murata Manufacturing; Part Number: GRM188R71H223KA01D; Type: Capacitor; ComponentLink1Description: Chip&Dip; ComponentLink1URL: https://www.chipdip.ru/product/grm188r71h223k
Cin = Cap 10uF (1210): 10uF X7R 10% 50V 1210; Manufacturer: Murata Manufacturing; Part Number: GRM32ER71H106KA12; Type: Capacitor; ComponentLink1Description: Chip&Dip; ComponentLink1URL: https://www.chipdip.ru/product/grm32er71h106k
Cout = Cap Pol 330uF: ECAP SMD,  16V, 105°C, 20%; Part Number: JCK1C331M080105; Manufacturer: JB; Type: Capacitor; ComponentLink1Description: Chip&Dip; ComponentLink1URL: https://www.chipdip.ru/product0/9000565746
Dout = Diode Schottky (SMA): as D12 on sheet AMS_LV_6; Type: Diode; ComponentLink1Description: DataSheet; ComponentLink1URL: https://static.chipdip.ru/lib/652/DOC001652710.pdf; ComponentLink2Description: Chip&Dip; ComponentLink2URL: https://www.chipdip.ru/product/b340a-e3-61t-2
Dtvs = TVS Diode 5V [PESD]: ESD Suppressor TVS 30KV,130W,  SOD-323; Part Number: PESD5V0S1BA,115; Manufacturer: Nexperia; Type: Diode; ComponentLink1Description: DataSheet; ComponentLink1URL: https://static.chipdip.ru/lib/160/DOC001160262.pdf; ComponentLink2Description: Chip&Dip; ComponentLink2URL: https://www.chipdip.ru/product/pesd5v0s1ba.115
Lout = Inductor 15uH (0.2..3.6A): 15uH, 1.53A, 7X7; Part Number: B82472G6153M000; Manufacturer: Epcos; Type: Inductor; ComponentLink1Description: DataSheet; ComponentLink1URL: https://static.chipdip.ru/lib/972/DOC003972643.pdf; ComponentLink2Description: Chip&Dip; ComponentLink2URL: https://www.chipdip.ru/product/b82472g6153m000-15
Rc = Res 4.7k (0603): 0.1W 0603 4.7k, 1%; Part Number: RC0603FR-074K7L; Manufacturer: Taiwan; Type: Resistor; ComponentLink1Description: Chip&Dip; ComponentLink1URL: https://www.chipdip.ru/product0/9000079728
Rf1 = Res 11k (0603): 0.1W 0603 11k, 1%; Part Number: RC0603FR-0711KL; Manufacturer: Taiwan; Type: Resistor; ComponentLink1Description: Chip&Dip; ComponentLink1URL: https://www.chipdip.ru/product0/9000079737
Rf2 = Res 3.3k (0603): 0.1W 0603 3.3k, 1%; Part Number: RC0603FR-073K3L; Manufacturer: Taiwan; Type: Resistor; ComponentLink1Description: Chip&Dip; ComponentLink1URL: https://www.chipdip.ru/product0/9000079724
Udcdc = DC/DC Controller [L5973]: The L5973AD is a step down monolithic power switching regulator with a switch current limit of 2 A so it is able to deliver more than 1.5 A DC current to the load depending on the application conditions; Manufacturer: STMicroelectronics; Part Number: L5973ADTR; ComponentLink1Description: Chip&Dip; ComponentLink1URL: https://www.chipdip.ru/product/l5973ad; ComponentLink2Description: DataSheet; ComponentLink2URL: https://static.chipdip.ru/lib/583/DOC001583165.pdf; Type: IC

## Nets that join several sheets
+5V: AMS_LV_6 (C7.2 U1.3 U2.3), DC-DC_4-36V_2A (Cout.2 Dtvs.1 Lout.2 Rf1.2)
BAT V+: AMS_LV_6 (23 pins), DC-DC_4-36V_2A (Cin.1 Udcdc.8)
BAT V-: AMS_LV_6 (88 pins), DC-DC_4-36V_2A (10 pins)